# EAGLE design Pi_grammer_MAIN (EAGLE 7.6.0)
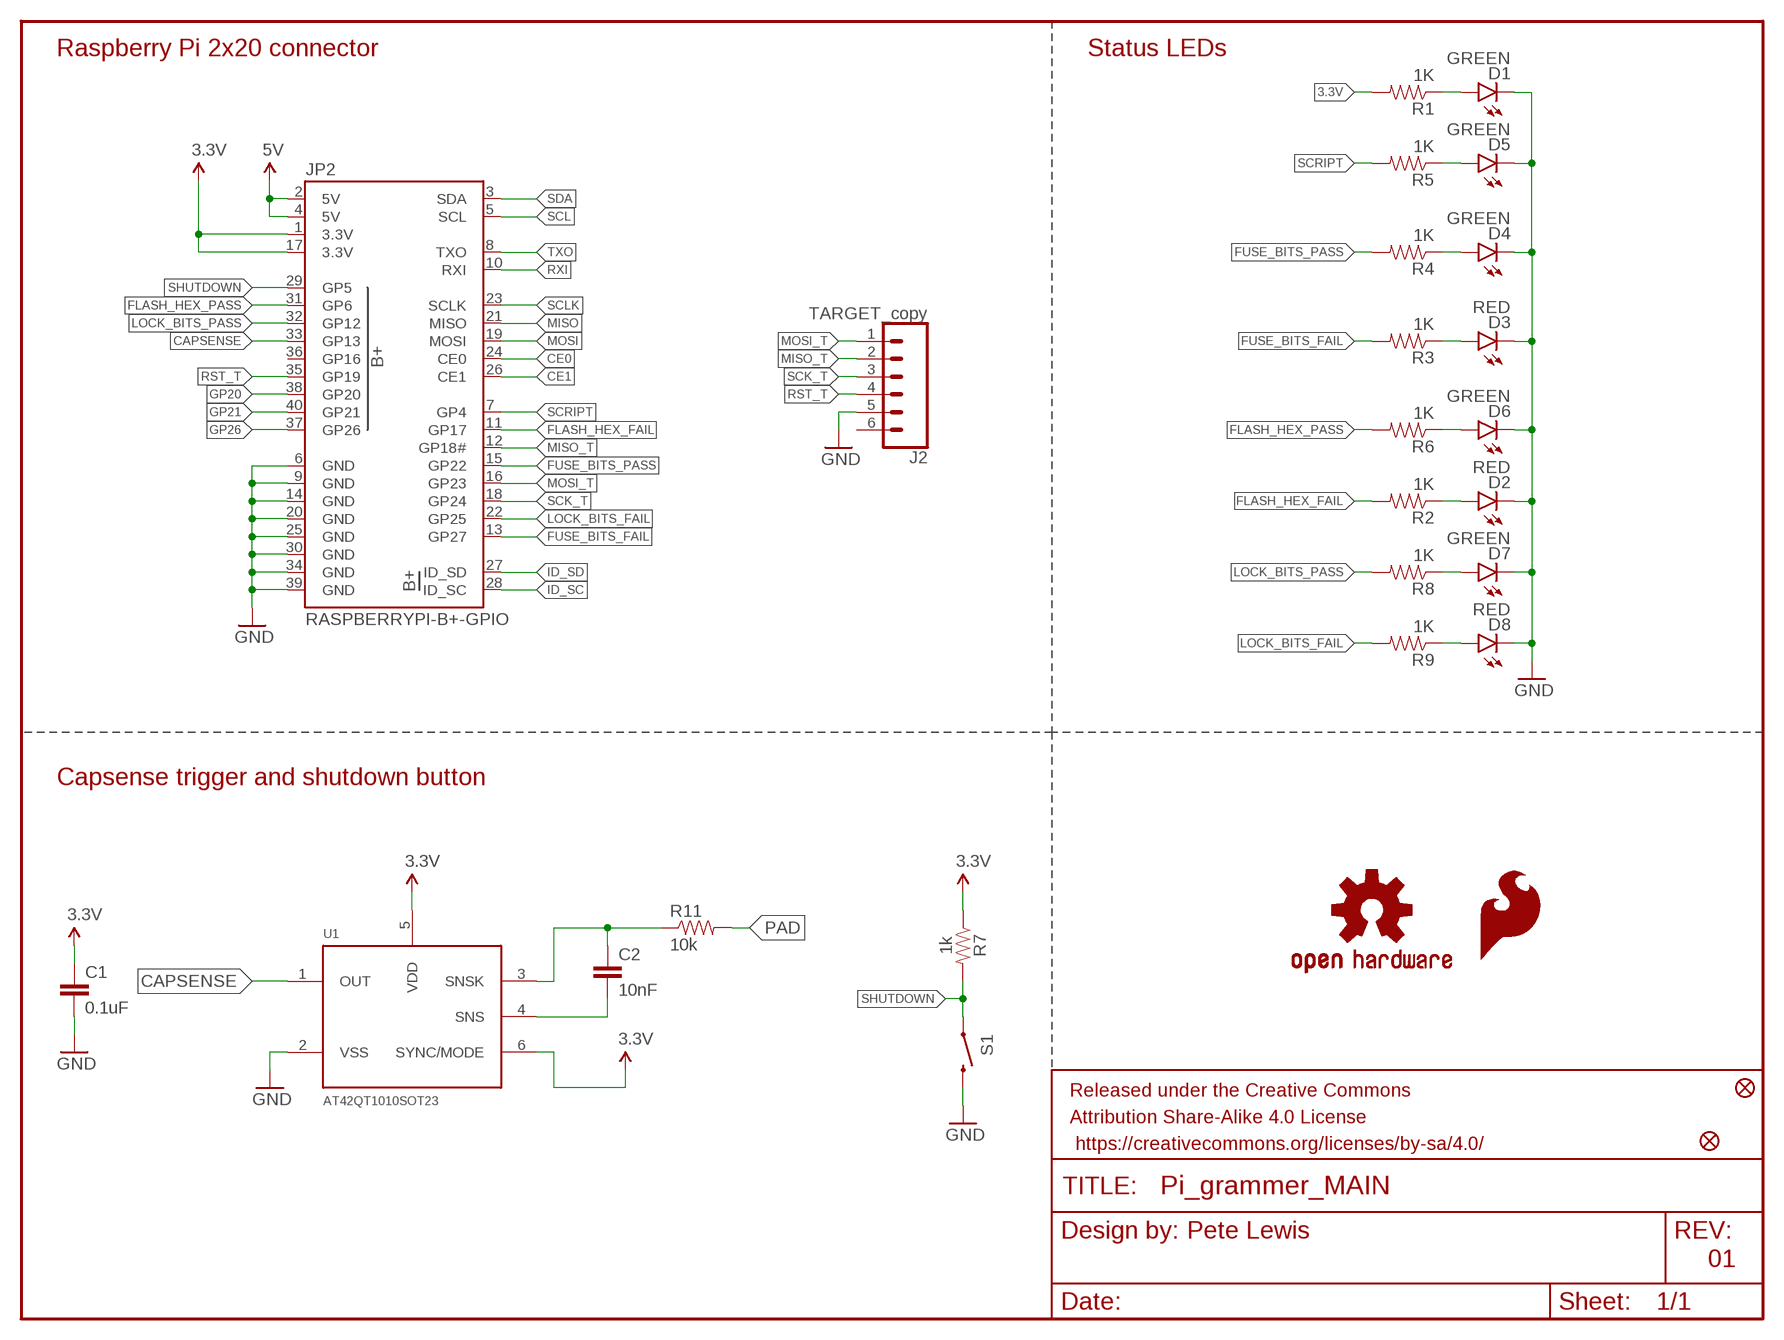
[diagram p0: schematic, sheet 1]

## Parts
C1  0.1uF  0.1UF-25V(+80/-20%)(0603)  [0603-CAP]
C2  10nF  10NF/10000PF-50V-10%(0603)  [0603-CAP]
D1  GREEN  LED-GREEN1206  [LED-1206]
D2  RED  LED-RED1206  [LED-1206]
D3  RED  LED-RED1206  [LED-1206]
D4  GREEN  LED-GREEN1206  [LED-1206]
D5  GREEN  LED-GREEN1206  [LED-1206]
D6  GREEN  LED-GREEN1206  [LED-1206]
D7  GREEN  LED-GREEN1206  [LED-1206]
D8  RED  LED-RED1206  [LED-1206]
FD1  FIDUCIALUFIDUCIAL  [FIDUCIAL-MICRO]
FD2  FIDUCIALUFIDUCIAL  [FIDUCIAL-MICRO]
FRAME1  FRAME-LETTER  [CREATIVE_COMMONS]
J2  TARGET_copy  CONN_06POLAR  [MOLEX-1X6]
JP2  RASPBERRYPI-B+-GPIO  [2X20-SHROUDED]
LOGO1  SFE_LOGO_FLAME.1_INCH  [SFE_LOGO_FLAME_.1]
LOGO2  OSHW-LOGOS  [OSHW-LOGO-S]
R1  1K  1KOHM-1/10W-1%(0603)  [0603-RES]
R2  1K  1KOHM-1/10W-1%(0603)  [0603-RES]
R3  1K  1KOHM-1/10W-1%(0603)  [0603-RES]
R4  1K  1KOHM-1/10W-1%(0603)  [0603-RES]
R5  1K  1KOHM-1/10W-1%(0603)  [0603-RES]
R6  1K  1KOHM-1/10W-1%(0603)  [0603-RES]
R7  1k  1KOHM-0603-1/10W-1%  [0603]
R8  1K  1KOHM-1/10W-1%(0603)  [0603-RES]
R9  1K  1KOHM-1/10W-1%(0603)  [0603-RES]
R11  10k  10KOHM-1/10W-1%(0603)0603  [0603-RES]
S1  SWITCH-MOMENTARY-2SMD  [TACTILE-SWITCH-SMD]
U1  AT42QT1010SOT23  [SOT23-6]

## Nets
3.3V: C1.1 JP2.1(3.3V) JP2.17(3.3V) R1.2 R7.1 U1.5(VDD) U1.6(SYNC/MODE)
5V: JP2.2(5V) JP2.4(5V)
CAPSENSE: JP2.33(GP13) U1.1(OUT)
CE0: JP2.24(CE0)
CE1: JP2.26(CE1)
FLASH_HEX_FAIL: JP2.11(GP17) R2.2
FLASH_HEX_PASS: JP2.31(GP6) R6.2
FUSE_BITS_FAIL: JP2.13(GP27) R3.2
FUSE_BITS_PASS: JP2.15(GP22) R4.2
GND: C1.2 D1.C D2.C D3.C D4.C D5.C D6.C D7.C D8.C J2.5 JP2.6(GND) JP2.9(GND) JP2.14(GND) JP2.20(GND) JP2.25(GND) JP2.30(GND) JP2.34(GND) JP2.39(GND) S1.3 U1.2(VSS)
GP20: JP2.38(GP20)
GP21: JP2.40(GP21)
GP26: JP2.37(GP26)
ID_SC: JP2.28(ID_SC)
ID_SD: JP2.27(ID_SD)
LOCK_BITS_FAIL: JP2.22(GP25) R9.2
LOCK_BITS_PASS: JP2.32(GP12) R8.2
MISO: JP2.21(MISO)
MISO_T: J2.2 JP2.12(GP18#)
MOSI: JP2.19(MOSI)
MOSI_T: J2.1 JP2.16(GP23)
N$1: D6.A R6.1
N$2: D1.A R1.1
N$3: D2.A R2.1
N$4: D3.A R3.1
N$5: D7.A R8.1
N$6: D4.A R4.1
N$7: D5.A R5.1
N$8: D8.A R9.1
N$10: C2.2 U1.4(SNS)
N$11: C2.1 R11.1 U1.3(SNSK)
PAD: R11.2
RST_T: J2.4 JP2.35(GP19)
RXI: JP2.10(RXI)
SCK_T: J2.3 JP2.18(GP24)
SCL: JP2.5(SCL)
SCLK: JP2.23(SCLK)
SCRIPT: JP2.7(GP4) R5.2
SDA: JP2.3(SDA)
SHUTDOWN: JP2.29(GP5) R7.2 S1.1
TXO: JP2.8(TXO)
Unconnected: J2.6 JP2.36(GP16)

## Notes on the sheet
- Raspberry Pi 2x20 connector | Status LEDs
- Capsense trigger and shutdown button
- Pete Lewis
- 01

## Library data of the parts
C1 = SparkFun-Capacitors:0.1UF-25V(+80/-20%)(0603): CAP-00810 Ceramic Standard decoupling cap; PROD_ID: CAP-00810
C2 = SparkFun-Capacitors:10NF/10000PF-50V-10%(0603): CAP-00867; PROD_ID: CAP-00867
D1 D4-D7 = SparkFun-LED:LED-GREEN: Various green LEDs Green LEDs used in SFE Production 0603- DIO-00821 LARGE- DIO-00862 LILYPAD- DIO-09910; PROD_ID: DIO-00862
D2 D3 D8 = SparkFun-LED:LED-RED: Assorted Red LEDs LilyPad 1206- DIO-09912 1206- DIO-00809 0603- DIO-00819 "SMART" means more efficient and expensive; PROD_ID: DIO-09912
FD1 FD2 = SparkFun-Aesthetics:FIDUCIAL: Fiducial Alignment Points Point-of-reference for pick-and-place machines and other optical instruments.
FRAME1 = SparkFun-Aesthetics:FRAME-LETTER: Schematic Frame - Letter Standard 8.5x11 US Letter frame
J2 = SparkFun-Connectors:CONN_06: Header 6 Standard 6-pin 0.1" header. Use with straight break away headers (SKU : PRT-00116), right angle break away headers (PRT-00553), swiss pins (PRT-00743), machine pins (PRT-00117), and female headers (PRT-00115). Molex polarized connector foot print use with SKU : PRT-08094 with associated crimp pins and housings. NOTES ON THE VARIANTS LOCK and LOCK_LONGPADS... This footprint was designed to help hold the alignment of a through-hole component (i.e. 6-pin header) while soldering it into place. You may notice that each hole has been shifted either up or down by 0.005 of an inch from it's more standard position (which is a perfectly straight line). This slight alteration caused the pins (the squares in the middle) to touch the edges of the holes. Because they are alternating, it causes a "brace" to hold the component in place. 0.005 has proven to be the perfect amount of "off-center" position when using our standard breakaway headers. Although looks a little odd when you look at the bare footprint, once you have a header in there, the alteration is very hard to notice. Also,if you push a header all the way into place, it is covered up entirely on the bottom side. This idea of altering the position of holes to aid alignment will be further integrated into the Sparkfun Library for other footprints. It can help hold any component with 3 or more connection pins.; PROD_ID: CONN-09698
JP2 = SparkFun-Boards:RASPBERRYPI-B+-GPIO: Raspberry Pi B+ GPIO Header 2x20 pin connector
LOGO1 = SparkFun-Aesthetics:SFE_LOGO_FLAME: SFE Logo, flame only This is the SparkFun flame logo. The logo on the schematic will always be the same size; the package variant is the height of the flame. Default layer for the logo on the board is tSilk.
LOGO2 = SparkFun-Aesthetics:OSHW-LOGO: Open Source Hardware Logo This logo indicates the piece of hardware it is found on incorporates a OSHW license and/or adheres to the definition of open source hardware found here: http://freedomdefined.org/OSHW
R1-R6 R8 R9 = SparkFun-Resistors:1KOHM-1/10W-1%(0603): RES-07856; PROD_ID: RES-07856
R7 = SparkFun-Resistors:1KOHM: 1kΩ resistor A resistor is a passive two-terminal electrical component that implements electrical resistance as a circuit element. Resistors act to reduce current flow, and, at the same time, act to lower voltage levels within circuits. - Wikipedia; PROD_ID: RES-07856
R11 = SparkFun-Resistors:10KOHM-1/10W-1%(0603): RES-00824; PROD_ID: RES-00824; VALUE: 10K
S1 = SparkFun-Electromechanical:SWITCH-MOMENTARY-2: Various NO switches- pushbuttons, reed, etc; PROD_ID: SWCH-08247
U1 = SparkFun-DigitalIC:AT42QT1010; PROD_ID: IC-11778

## Board
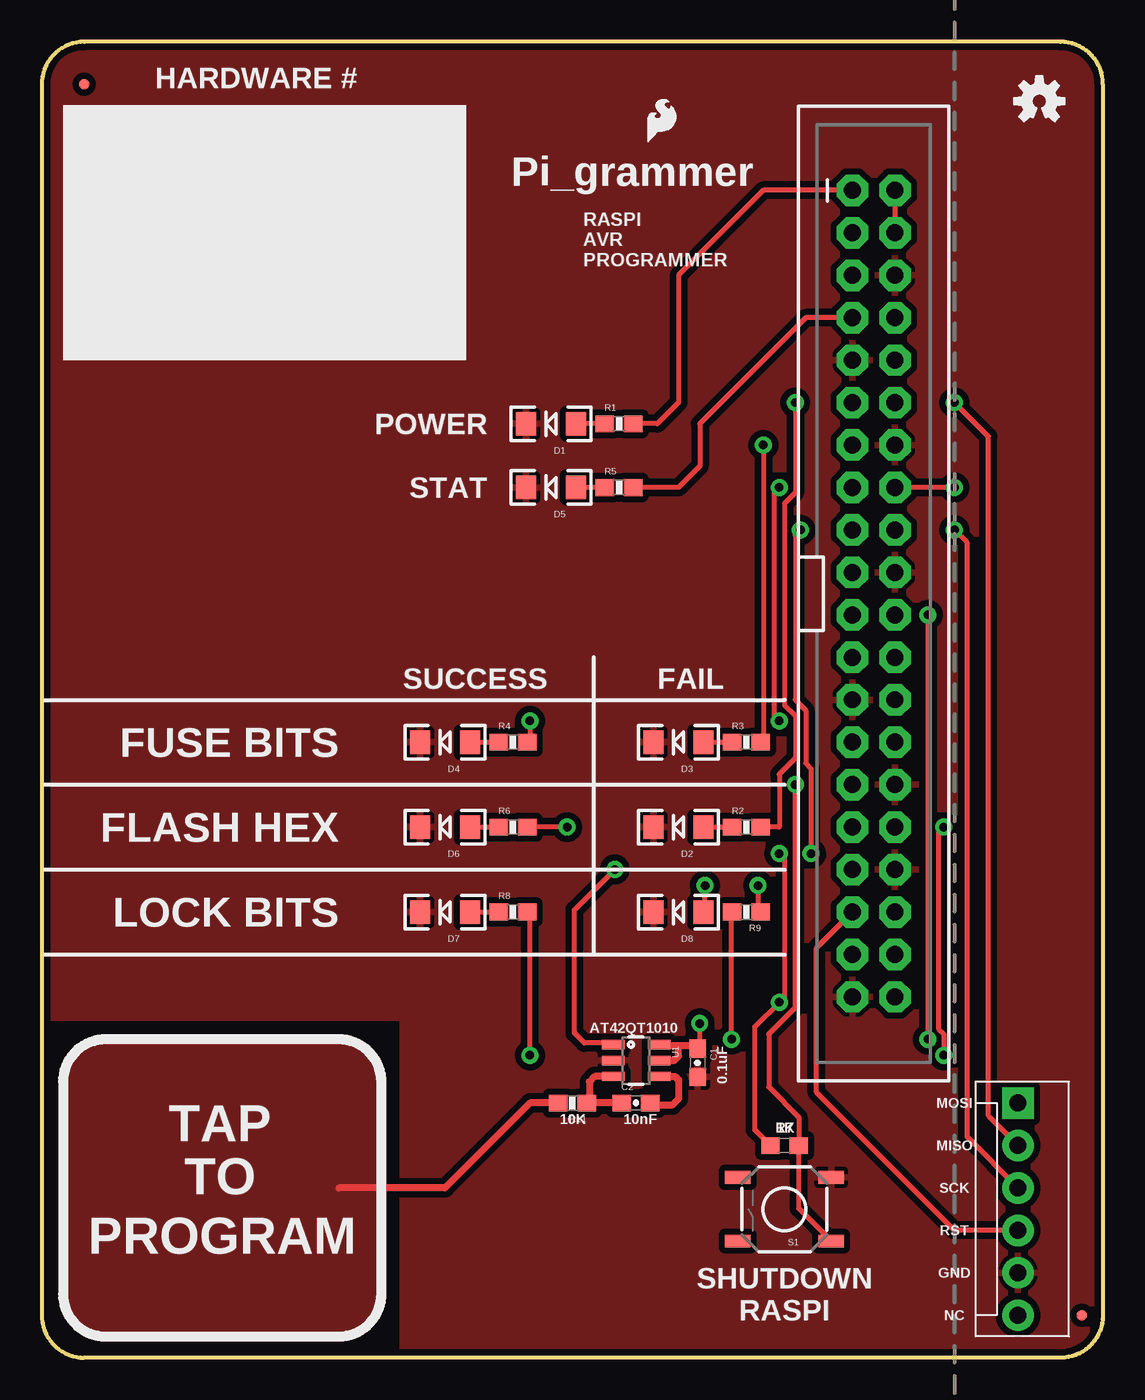
[diagram p1: board, top side]
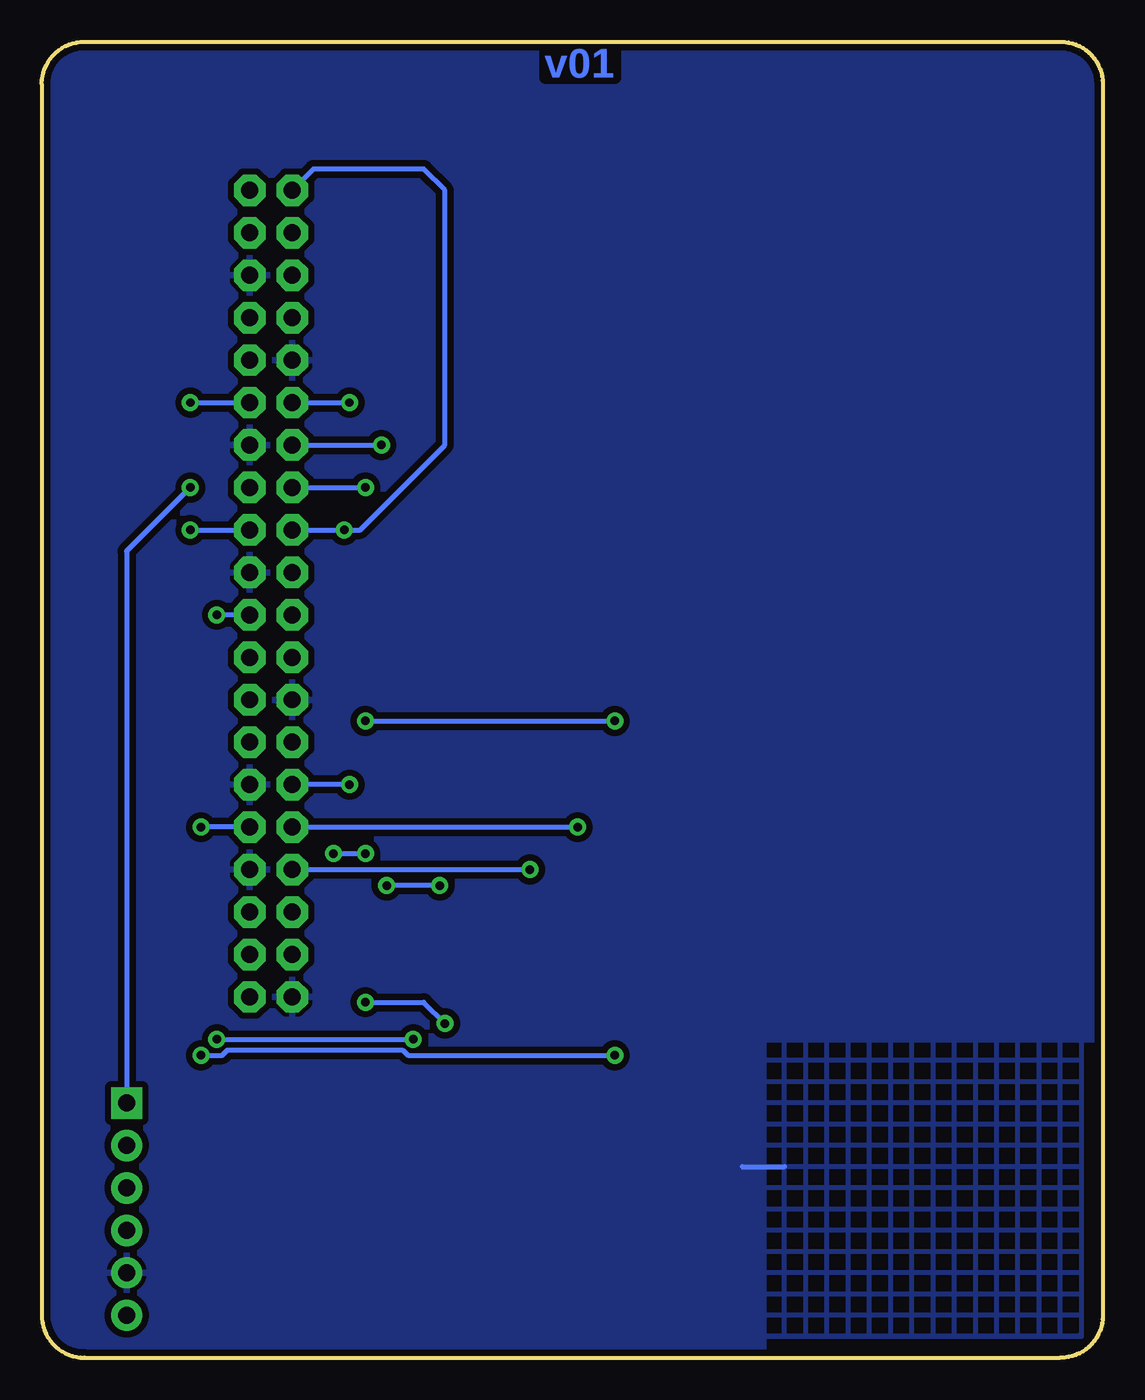
[diagram p2: board, bottom side, seen from below]

Size 63.5 x 78.74 mm. Coordinates in mm from the lower left corner, seen from the top.
Outline: 63.5,76.2 arc90 60.96,78.74 2.54,78.74 arc90 0,76.2 0,2.54 arc90 2.54,0 60.96,0 arc90 63.5,2.54 63.5,76.2
Copper layers (1*16): Top 0.035mm / dielectric 1.5mm / Bottom 0.035mm
Design rules "SparkFun-2-layer *": minimum track width 12mil, minimum drill 20mil, track to track 8mil, track to pad 8mil, pad to pad 8mil, via to via 8mil, smd to smd 8mil, copper to edge 8mil, drill to drill 8mil, minimum pad ring 12mil, minimum via ring 10mil, stop-mask expansion 4mil, vias tented up to drill 20mil, thermal gap 10mil

### Footprints (pad centres in the part's own frame; a part is rotated, then mirrored left to right if it is on the bottom)
0603-CAP = smd 1.1 x 1: 1 -0.85,0; 2 0.85,0
LED-1206 = smd 1.2 x 1.4: A -1.5,0; C 1.5,0
FIDUCIAL-MICRO = smd 0.635 x 0.635: 1 0,0
MOLEX-1X6 = drill 1.016 pad 1.88 square: 1 0,0 | drill 1.016 pad 1.88: 2 2.54,0; 3 5.08,0; 4 7.62,0; 5 10.16,0; 6 12.7,0
2X20-SHROUDED = drill 1.016 pad 1.88 octagon: 1 -1.27,24.13; 2 1.27,24.13; 3 -1.27,21.59; 4 1.27,21.59; 5 -1.27,19.05; 6 1.27,19.05; 7 -1.27,16.51; 8 1.27,16.51; 9 -1.27,13.97; 10 1.27,13.97; 11 -1.27,11.43; 12 1.27,11.43; 13 -1.27,8.89; 14 1.27,8.89; 15 -1.27,6.35; 16 1.27,6.35; 17 -1.27,3.81; 18 1.27,3.81; 19 -1.27,1.27; 20 1.27,1.27; 21 -1.27,-1.27; 22 1.27,-1.27; 23 -1.27,-3.81; 24 1.27,-3.81; 25 -1.27,-6.35; 26 1.27,-6.35; 27 -1.27,-8.89; 28 1.27,-8.89; 29 -1.27,-11.43; 30 1.27,-11.43; 31 -1.27,-13.97; 32 1.27,-13.97; 33 -1.27,-16.51; 34 1.27,-16.51; 35 -1.27,-19.05; 36 1.27,-19.05; 37 -1.27,-21.59; 38 1.27,-21.59; 39 -1.27,-24.13; 40 1.27,-24.13
0603-RES = smd 1.1 x 1: 1 -0.85,0; 2 0.85,0
0603 = smd 1.1 x 1: 1 -0.85,0; 2 0.85,0
TACTILE-SWITCH-SMD = smd 1.524 x 0.762: 1 -2.794,1.905; 2 2.794,1.905; 3 -2.794,-1.905; 4 2.794,-1.905
SOT23-6 = smd 0.55 x 1.35: 1 -0.95,-1.375; 2 0,-1.375; 3 0.95,-1.375; 4 0.95,1.375; 5 0,1.375; 6 -0.95,1.375

### Placement (x,y rotation side)
C1  39.24,17.65 270 top
C2  35.56,15.24 0 top
D1  30.48,55.88 180 top
D2  38.1,31.75 180 top
D3  38.1,36.83 180 top
D4  24.13,36.83 180 top
D5  30.48,52.07 180 top
D6  24.13,31.75 180 top
D7  24.13,26.67 180 top
D8  38.1,26.67 180 top
FD1  2.54,76.2 0 top
FD2  62.23,2.54 0 top
FRAME1  21.59,-21.59 0 top  (outside the outline)
J2  58.42,15.24 270 top
JP2  49.78,45.72 0 top
LOGO1  35.94,72.39 0 top
LOGO2  59.69,75.18 0 top
R1  34.54,55.88 0 top
R2  42.16,31.75 0 top
R3  42.16,36.83 0 top
R4  28.19,36.83 0 top
R5  34.54,52.07 0 top
R6  28.19,31.75 0 top
R7  44.45,12.7 0 top
R8  28.19,26.67 0 top
R9  42.16,26.67 180 top
R11  31.75,15.24 180 top
S1  44.45,8.89 180 top
U1  35.56,17.78 270 top

### Tracks (layer width: path | path; a pad name or v marks a point on that pad's centre or on a via)
3.3V  (via drill 0.51)
  Top 0.305: JP2.1 43.18,69.85 38.1,64.77 38.1,57.15 36.83,55.88 R1.2 | v39.37,20 39.37,18.73 39.24,18.61 C1.1 | v44.13,30.16 44.45,29.84 44.45,21.27 v44.13,21.27 42.67,19.81 42.67,13.63 R7.1 | v46.04,30.16 46.04,35.24 45.72,35.56 45.72,38.73 45.09,39.37 45.09,49.21 v45.4,49.53
  Top 0.406: U1.5 37.85,17.78 38.1,18.03 38.1,18.67 | 38.1,18.67 37,18.67 U1.6 | C1.1 39.08,18.67 38.1,18.67
  Bottom 0.305: JP2.17 v45.4,49.53 44.45,49.53 39.37,54.61 39.37,69.85 40.64,71.12 47.24,71.12 JP2.1 | v46.04,30.16 v44.13,30.16 | v44.13,21.27 40.64,21.27 v39.37,20
5V
  Top 0.305: JP2.2 JP2.4
CAPSENSE  (via drill 0.51)
  Top 0.305: U1.1 34.29,18.84 32.47,18.84 31.88,19.43 31.88,26.8 v34.29,29.21
  Bottom 0.305: JP2.33 v34.29,29.21
FLASH_HEX_FAIL  (via drill 0.51)
  Top 0.305: R2.2 44.13,31.75 44.13,34.92 45.09,35.88 45.09,38.42 44.45,39.05 44.45,51.12 45.09,51.75 v45.09,57.15
  Bottom 0.305: JP2.11 v45.09,57.15
FLASH_HEX_PASS  (via drill 0.51)
  Top 0.305: v31.43,31.75 R6.2
  Bottom 0.305: JP2.31 v31.43,31.75
FUSE_BITS_FAIL  (via drill 0.51)
  Top 0.305: v43.18,54.61 43.18,36.83 R3.2
  Bottom 0.305: JP2.13 v43.18,54.61
FUSE_BITS_PASS  (via drill 0.51)
  Top 0.305: v29.21,38.1 29.21,36.83 R4.2 | v44.13,38.1 43.81,38.42 43.81,51.75 v44.13,52.07
  Bottom 0.305: v44.13,38.1 v29.21,38.1 | JP2.15 v44.13,52.07
GND
  Bottom 0.305: 21.59,11.43 19.05,11.43
  pour Bottom (isolate 0.381): 0,78.74 63.5,78.74 63.5,0 20.32,0 20.32,19.05 0,19.05
  pour Top (isolate 0.381): 0,78.74 63.5,78.74 63.5,0 21.59,0 21.59,20.32 0,20.32
  pour Bottom (isolate 0.305, hatched): 20.32,1.27 1.27,1.27 1.27,19.05 20.32,19.05
LOCK_BITS_FAIL  (via drill 0.51)
  Top 0.305: v41.27,19.05 41.27,26.67 R9.2 | v53.02,44.45 v53.02,19.05
  Bottom 0.305: v53.02,19.05 v41.27,19.05 | JP2.22 v53.02,44.45
LOCK_BITS_PASS  (via drill 0.51)
  Top 0.305: v29.21,18.1 29.21,26.67 R8.2 | v53.98,18.1 53.98,19.37 53.66,19.68 53.66,31.43 v53.98,31.75
  Bottom 0.305: v29.21,18.1 41.59,18.1 41.91,18.41 52.39,18.41 52.7,18.1 v53.98,18.1 | JP2.32 v53.98,31.75
MISO_T  (via drill 0.51)
  Top 0.305: v54.61,57.15 56.64,55.12 56.64,14.48 J2.2
  Bottom 0.305: v54.61,57.15 JP2.12
MOSI_T  (via drill 0.51)
  Top 0.305: v54.61,52.07 JP2.16
  Bottom 0.305: v54.61,52.07 58.42,48.26 J2.1
N$1
  Top 0.305: D6.A R6.1
N$2
  Top 0.305: R1.1 D1.A
N$3
  Top 0.305: D2.A R2.1
N$4
  Top 0.305: D3.A R3.1
N$5
  Top 0.305: D7.A R8.1
N$6
  Top 0.305: D4.A R4.1
N$7
  Top 0.305: R5.1 D5.A
N$8  (via drill 0.51)
  Top 0.305: v42.86,28.26 42.86,26.67 R9.1 | v39.69,28.26 39.69,26.67 D8.A
  Bottom 0.305: v39.69,28.26 v42.86,28.26
N$10
  Top 0.406: U1.4 37.91,16.83 38.1,16.64 38.1,15.49 37.72,15.11 36.54,15.11 C2.2
N$11
  Top 0.406: U1.3 33.09,16.83 32.77,16.51 32.77,15.41 R11.1 C2.1
PAD
  Top 0.406: R11.2 29.21,15.24 24.13,10.16 17.78,10.16
  pour Top (isolate 0.305): 20.32,16.51 arc90 17.78,19.05 3.81,19.05 arc90 1.27,16.51 1.27,3.81 arc90 3.81,1.27 17.78,1.27 arc90 20.32,3.81
RST_T
  Top 0.305: JP2.35 46.35,24.51 46.35,15.88 54.61,7.62 J2.4
SCK_T  (via drill 0.51)
  Top 0.305: v54.61,49.53 55.37,48.77 55.37,13.21 J2.3
  Bottom 0.305: v54.61,49.53 JP2.18
SCRIPT
  Top 0.305: JP2.7 45.72,62.23 39.37,55.88 39.37,53.34 38.1,52.07 R5.2
SHUTDOWN  (via drill 0.51)
  Top 0.305: v45.09,34.29 45.09,20.95 43.5,19.37 43.5,16.19 45.3,14.39 R7.2 45.3,8.93 S1.1
  Bottom 0.305: v45.09,34.29 JP2.29

### Text on the board
Bottom: v01
tPlace: HARDWARE # | Pi_grammer | RASPI / AVR / PROGRAMMER | POWER | STAT | SUCCESS | FAIL | FUSE BITS | FLASH HEX | LOCK BITS | AT42QT1010 | 0.1uF | MOSI | 10K | 10nF | TAP | 1K | MISO | TO | SCK | RST | PROGRAM | GND | SHUTDOWN / RASPI | NC
tDocu: EDGE of raspi enclosure | Pete Lewis